# Altium project apu.PrjPcb
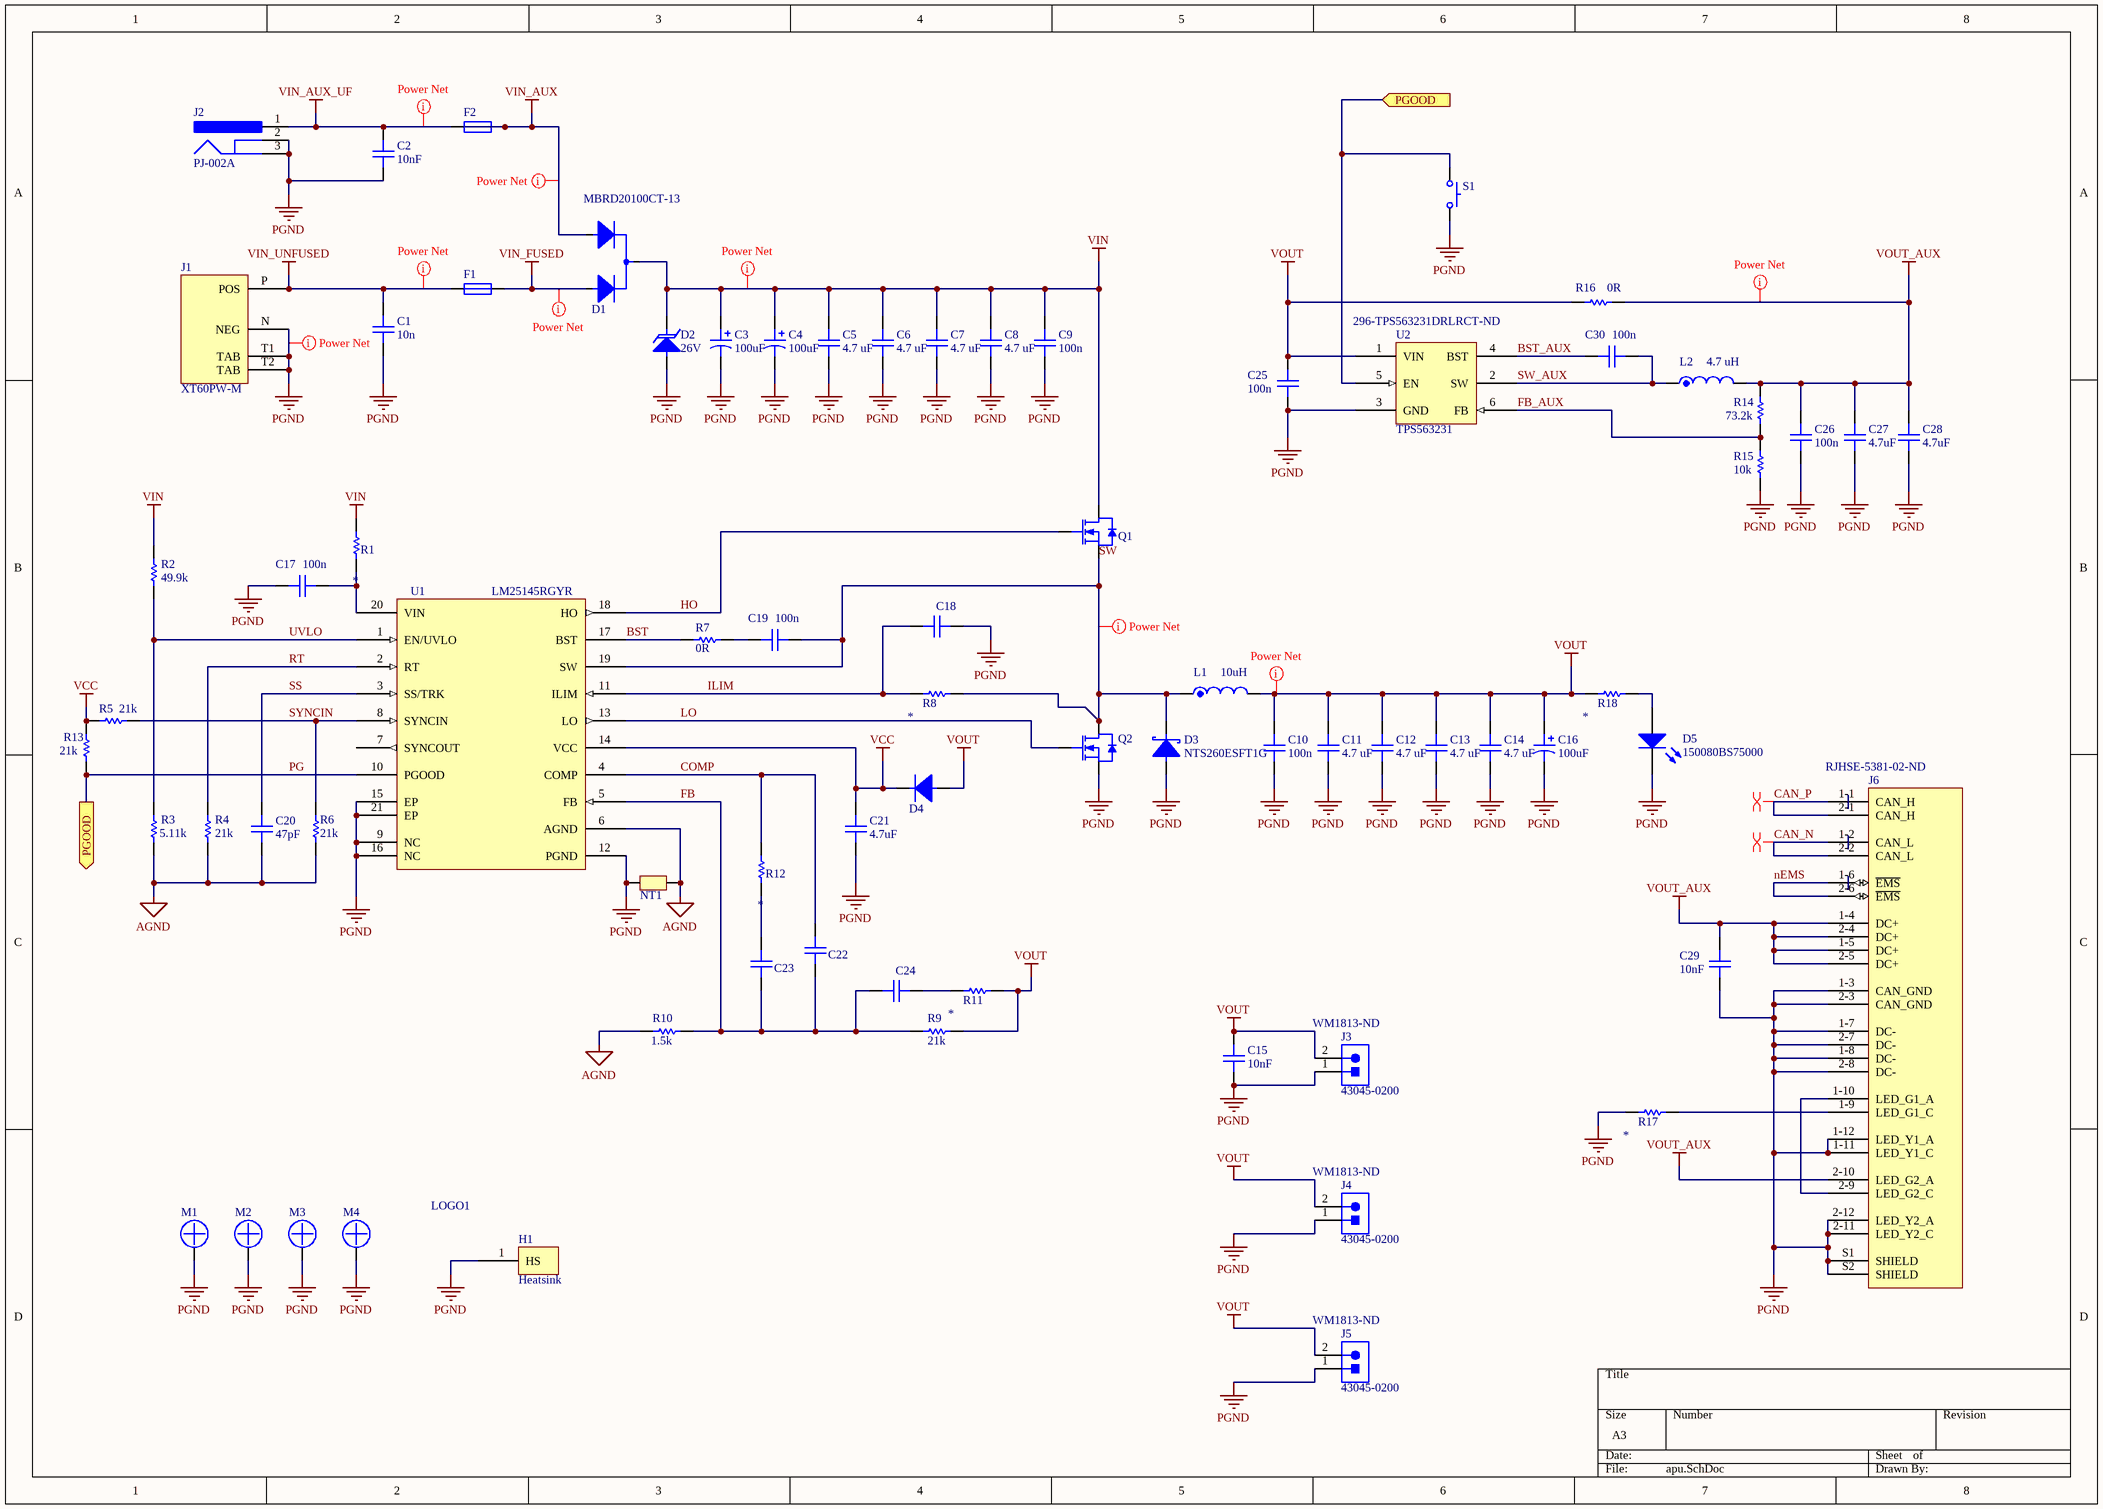
[diagram p0: apu.SchDoc]
1 sheet, 75 parts. Net scope: flat (ports and power ports of the same name join across sheets).
Board files: apu.PcbDoc, apu_panelized.PcbDoc

## Sheet apu.SchDoc
size A3

### Parts
C1  Capacitance: 10n  [C0603N]  (hidden comment: C)
C2  Capacitance: 10nF  [C0603N]  (hidden comment: C)
C3  Capacitance: 100uF  [CPOL_8x11_5_THRU]  (hidden comment: UHE1H101MPD)
C4  Capacitance: 100uF  [CPOL_8x11_5_THRU]  (hidden comment: UHE1H101MPD)
C5  Capacitance: 4.7 uF  [C1210N]  (hidden comment: UMK325B7475MM-P)
C6  Capacitance: 4.7 uF  [C1210N]  (hidden comment: UMK325B7475MM-P)
C7  Capacitance: 4.7 uF  [C1210N]  (hidden comment: UMK325B7475MM-P)
C8  Capacitance: 4.7 uF  [C1210N]  (hidden comment: UMK325B7475MM-P)
C9  DisplayValue: 100n  [C0603N]  (hidden comment: C)
C10  DisplayValue: 100n  [C0603N]  (hidden comment: C)
C11  Capacitance: 4.7 uF  [C1210N]  (hidden comment: UMK325B7475MM-P)
C12  Capacitance: 4.7 uF  [C1210N]  (hidden comment: UMK325B7475MM-P)
C13  Capacitance: 4.7 uF  [C1210N]  (hidden comment: UMK325B7475MM-P)
C14  Capacitance: 4.7 uF  [C1210N]  (hidden comment: UMK325B7475MM-P)
C15  Capacitance: 10nF  [C0603N]  (hidden comment: C)
C16  Capacitance: 100uF  [CPOL_8x11_5_THRU]  (hidden comment: UHE1H101MPD)
C17  DisplayValue: 100n  [C0603N]  (hidden comment: C)
C18  (no value)  [C0603N]
C19  DisplayValue: 100n  [C0603N]  (hidden comment: C)
C20  Capacitance: 47pF  [C0603N]  (hidden comment: 885012006055)
C21  Capacitance: 4.7uF  [C0805N]  (hidden comment: TMK212ABJ475KG-T)
C22  (no value)  [C0603N]
C23  (no value)  [C0603N]
C24  (no value)  [C0603N]
C25  DisplayValue: 100n  [C0603N]  (hidden comment: C)
C26  DisplayValue: 100n  [C0603N]  (hidden comment: C)
C27  Capacitance: 4.7uF  [C0805N]  (hidden comment: TMK212ABJ475KG-T)
C28  Capacitance: 4.7uF  [C0805N]  (hidden comment: TMK212ABJ475KG-T)
C29  Capacitance: 10nF  [C0603N]  (hidden comment: C)
C30  DisplayValue: 100n  [C0603N]  (hidden comment: C)
D1  MBRD20100CT-13  [DPAK_JEDEC_N]
D2  Reverse Standoff Voltage: 26V  [SMB]  (hidden comment: SMBJ26A-E3/52)
D3  NTS260ESFT1G  [SOD-123FLN]
D4  (no value)  [SOD323FLN]
D5  150080BS75000  [0805_A]
F1  FUSE  [LITTELFUSE_154]  (value not drawn)
F2  FUSE  [LITTELFUSE_154]  (value not drawn)
H1  Heatsink  [HS_2510]
J1  XT60PW-M  [XT60PW-M]
J2  PJ-002A  [CUI-PJ-002A_V]
J3  43045-0200  Supplier Part Number 1: WM1813-ND  [43045-020X]
J4  43045-0200  Supplier Part Number 1: WM1813-ND  [43045-020X]
J5  43045-0200  Supplier Part Number 1: WM1813-ND  [43045-020X]
J6  Supplier Part Number 1: RJHSE-5381-02-ND  [RJHSE-X38X-02]  (hidden comment: RJHSE-5381-02)
L1  Inductance: 10uH  [SRP1265A]  (hidden comment: SRP1265A-100M)
L2  Capacitance: 4.7 uH  [VLS5045EX_TDK]
LOGO1  LOGO  [LOGO_designed_by_ysk]  (value not drawn)  (graphical)
M1  Mounting_Screw  [MOUNT_HOLE_3.2]  (value not drawn)  (no BOM)
M2  Mounting_Screw  [MOUNT_HOLE_3.2]  (value not drawn)  (no BOM)
M3  Mounting_Screw  [MOUNT_HOLE_3.2]  (value not drawn)  (no BOM)
M4  Mounting_Screw  [MOUNT_HOLE_3.2]  (value not drawn)  (no BOM)
NT1  Net tie  [NET_TIE_0_2]  (value not drawn)  (net tie, no BOM)
Q1  MOSFET-N  [DFN-5 (SO-8FL)]  (value not drawn)
Q2  MOSFET-N  [DFN-5 (SO-8FL)]  (value not drawn)
R1  R  [R0603N]  (value not drawn)
R2  Resistance: 49.9k  [R0603N]  (hidden comment: R)
R3  Resistance: 5.11k  [R0603N]  (hidden comment: R)
R4  Resistance: 21k  [R0603N]  (hidden comment: R)
R5  Resistance: 21k  [R0603N]  (hidden comment: R)
R6  Resistance: 21k  [R0603N]  (hidden comment: R)
R7  Resistance: 0R  [R0603N]  (hidden comment: R)
R8  R  [R0603N]  (value not drawn)
R9  Resistance: 21k  [R0603N]  (hidden comment: R)
R10  Resistance: 1.5k  [R0603N]  (hidden comment: R)
R11  R  [R0603N]  (value not drawn)
R12  R  [R0603N]  (value not drawn)
R13  Resistance: 21k  [R0603N]  (hidden comment: R)
R14  Resistance: 73.2k  [R0603N]  (hidden comment: R)
R15  Resistance: 10k  [R0603N]  (hidden comment: R)
R16  Resistance: 0R  [R1206N]  (hidden comment: R)
R17  R  [R0603N]  (value not drawn)
R18  R  [R0603N]  (value not drawn)
S1  SW  [SW_TACTILE_3x6]  (value not drawn)
U1  Manufacturer Part Number 1: LM25145RGYR  [RGY0020B_TI_N]
U2  TPS563231  Supplier Part Number 1: 296-TPS563231DRLRCT-ND  [DRL0006A_TI_N]

### Ports
PGOOD (in), PGOOD (out)

### Nets
AGND: C20.1 NT1.2 R3.1 R4.1 R6.2 R10.1 U1.6(AGND)
PGND: C1.2 C2.2 C3.2 C4.2 C5.1 C6.1 C7.1 C8.1 C9.2 C10.2 C11.1 C12.1 C13.1 C14.1 C15.2 C16.2 C17.2 C18.1 C21.1 C25.2 C26.2 C27.1 C28.1 C29.2 D2.2(A) D3.2(A) D5.1(K) H1.1(HS) J1.N(NEG) J1.T1(TAB) J1.T2(TAB) J2.2 J2.3 J3.1 J4.1 J5.1 J6.1-3(CAN_GND) J6.1-7(DC-) J6.1-8(DC-) J6.1-11(LED_Y1_C) J6.1-12(LED_Y1_A) J6.2-3(CAN_GND) J6.2-7(DC-) J6.2-8(DC-) J6.2-11(LED_Y2_C) J6.2-12(LED_Y2_A) J6.S1(SHIELD) J6.S2(SHIELD) M1.1 M2.1 M3.1 M4.1 NT1.1 Q2.S R15.1 R17.2 S1.1 U1.9(NC) U1.12(PGND) U1.15(EP) U1.16(NC) U1.21(EP) U2.3(GND)
VCC: C21.2 D4.1(C) R5.2 R13.2 U1.14(VCC)
VIN: C3.1 C4.1 C5.2 C6.2 C7.2 C8.2 C9.1 D1.2(C) D2.1(C) Q1.D R1.1 R2.2
VIN_AUX: D1.3(A2) F2.2
VIN_AUX_UF: C2.1 F2.1 J2.1
VIN_FUSED: D1.1(A1) F1.2
VIN_UNFUSED: C1.1 F1.1 J1.P(POS)
VOUT: C10.1 C11.2 C12.2 C13.2 C14.2 C15.1 C16.1 C25.1 D4.2(A) J3.2 J4.2 J5.2 L1.2 R9.2 R11.2 R16.1 R18.2 U2.1(VIN)
VOUT_AUX: C26.1 C27.2 C28.2 C29.1 J6.1-4(DC+) J6.1-5(DC+) J6.2-4(DC+) J6.2-5(DC+) J6.2-10(LED_G2_A) L2.2 R14.2 R16.2
BST: R7.1 U1.17(BST)
BST_AUX: C30.1 U2.4(BST)
CAN_N: J6.1-2(CAN_L) J6.2-2(CAN_L)
CAN_P: J6.1-1(CAN_H) J6.2-1(CAN_H)
COMP: C22.1 R12.2 U1.4(COMP)
FB: C22.2 C23.2 C24.2 R9.1 R10.2 U1.5(FB)
FB_AUX: R14.1 R15.2 U2.6(FB)
HO: Q1.G U1.18(HO)
ILIM: C18.2 R8.1 U1.11(ILIM)
LO: Q2.G U1.13(LO)
nEMS: J6.1-6(~{EMS}) J6.2-6(~{EMS})
PG: R13.1 S1.1 U1.10(PGOOD) U2.5(EN) ; port PGOOD
RT: R4.2 U1.2(RT)
SS: C20.2 U1.3(SS/TRK)
SW: C19.1 D3.1(C) L1.1 Q1.S Q2.D R8.2 U1.19(SW)
SW_AUX: C30.2 L2.1 U2.2(SW)
SYNCIN: R5.1 R6.1 U1.8(SYNCIN)
UVLO: R2.1 R3.2 U1.1(EN/UVLO)
NetC17_1: C17.1 R1.2 U1.20(VIN)
NetC19_2: C19.2 R7.2
NetC23_1: C23.1 R12.1
NetC24_1: C24.1 R11.1
NetD5_2: D5.2(A) R18.1
NetJ6_1-9: J6.1-9(LED_G1_C) R17.1
NetJ6_1-10: J6.1-10(LED_G1_A) J6.2-9(LED_G2_C)

Not connected (* = marked no-connect by the designer): U1 7(SYNCOUT)

### Layout directives
net class Power: PGND, SW, VIN, VIN_AUX, VIN_AUX_UF, VIN_FUSED, VIN_UNFUSED, VOUT, VOUT_AUX
differential pair: CAN_N, CAN_P

### Library data of the parts
C1 C2 C15 C29 = C: CAP CER, 0.01UF, 50V, X7R, +/-20%, 0603; Manufacturer 1: Any; Voltage: 50V; Dielectric: X7R
C3 C4 = CPOL: CAP ALUM 100UF 20% 50V RADIAL; Manufacturer 1: Nichicon; Dielectric Material: Aluminium; Life (Hours): 7000Hour; Ripple Current: 555mA; Impedance: 170mR; ESR (Equivalent Series Resistance): 680mR; Dissipation Factor: 0.1%; Leakage Current: 50uA; Lead Diameter: 0.6mm; Supplier 1: Digi-Key; Supplier Part Number 1: 493-1605-ND; Manufacturer Part Number 1: UHE1H101MPD; RoHS: Yes; Category: Aluminum Electrolytic Capacitors; Stock 1: 29617; Pricing 1: 1=0.45000, 10=0.31600, 100=0.20800, 500=0.15408, 1000=0.13097, 2500=0.12326, 5000=0.11556 (USD); Mount: Through Hole; Case/Package: Radial; Min Operating Temperature: -40°C; Max Operating Temperature: 105°C; Termination: Radial; Voltage Rating: 50V; Tolerance: 20%; Packaging: Bulk; Package Quantity: 200; Voltage: 50V; Voltage Rating (DC): 50V; Diameter: 8mm; Length: 11.5mm; Height: 11.5mm; Height - Seated (Max): 0.453inch; Lead Pitch: 3.5mm; Radiation Hardening: No; REACH SVHC: No SVHC; Lead Free: Lead Free; ComponentLink1URL: https://datasheet.ciiva.com/11782/0900766b80634fdd-11782865.pdf?src-supplier=RSComponents; ComponentLink1Description: https://datasheet.ciiva.com/11782/0900766b80634fdd-11782865.pdf?src-supplier=RSComponents; ComponentLink2URL: https://datasheet.ciiva.com/98/e-he-98380.pdf?src-supplier=Digi-Key; ComponentLink2Description: https://datasheet.ciiva.com/98/e-he-98380.pdf?src-supplier=Digi-Key; ComponentLink3URL: https://datasheet.ciiva.com/11685/e-he-11685006.pdf?src-supplier=Avnet; ComponentLink3Description: https://datasheet.ciiva.com/11685/e-he-11685006.pdf?src-supplier=Avnet
C5-C8 C11-C14 = C: CAP CER 4.7UF 50V X7R 1210; Manufacturer 1: Taiyo Yuden; Manufacturer Part Number 1: UMK325B7475MM-P; Voltage: 50 V; Dielectric: X7R
C9 C10 C17 C19 C25 C26 C30 = C: CAP CER, 0.1UF, 50V, X7R, +/-20%, 0603; Manufacturer 1: Any; Capacitance: 100 nF
  C9 C10 C25 C26 C30: Voltage: 50 V; Dielectric: X7R
  C17: ClassName: Controller; Voltage: 50 V; Dielectric: X7R
  C19: ClassName: Controller
C16 = CPOL: CAP ALUM 100UF 20% 50V RADIAL; Manufacturer 1: Nichicon; Dielectric Material: Aluminium; Ripple Current: 555mA; Life (Hours): 7000Hour; Impedance: 170mR; ESR (Equivalent Series Resistance): 680mR; Dissipation Factor: 0.1%; Leakage Current: 50uA; Lead Diameter: 0.6mm; Supplier 1: Digi-Key; Supplier Part Number 1: 493-1605-ND; Manufacturer Part Number 1: UHE1H101MPD; RoHS: Yes; Category: Aluminum Electrolytic Capacitors; Stock 1: 29617; Pricing 1: 1=0.45000, 10=0.31600, 100=0.20800, 500=0.15408, 1000=0.13097, 2500=0.12326, 5000=0.11556 (USD); Mount: Through Hole; Case/Package: Radial; Min Operating Temperature: -40°C; Max Operating Temperature: 105°C; Termination: Radial; Tolerance: 20%; Voltage Rating: 50V; Packaging: Bulk; Package Quantity: 200; Voltage: 50V; Voltage Rating (DC): 50V; Diameter: 8mm; Length: 11.5mm; Height: 11.5mm; Lead Pitch: 3.5mm; Height - Seated (Max): 0.453inch; Radiation Hardening: No; REACH SVHC: No SVHC; Lead Free: Lead Free; ComponentLink1URL: https://datasheet.ciiva.com/11782/0900766b80634fdd-11782865.pdf?src-supplier=RSComponents; ComponentLink1Description: https://datasheet.ciiva.com/11782/0900766b80634fdd-11782865.pdf?src-supplier=RSComponents; ComponentLink2URL: https://datasheet.ciiva.com/98/e-he-98380.pdf?src-supplier=Digi-Key; ComponentLink2Description: https://datasheet.ciiva.com/98/e-he-98380.pdf?src-supplier=Digi-Key; ComponentLink3URL: https://datasheet.ciiva.com/11685/e-he-11685006.pdf?src-supplier=Avnet; ComponentLink3Description: https://datasheet.ciiva.com/11685/e-he-11685006.pdf?src-supplier=Avnet
C18 C22-C24 = C: ClassName: Controller
C20 = C: CAP CER 47PF 50V C0G/NP0 0603; Manufacturer 1: Wurth Electronics; Tolerance: 5%; ClassName: Controller; Supplier 1: Digi-Key; Supplier Part Number 1: 732-7797-1-ND; Manufacturer Part Number 1: 885012006055; RoHS: Yes; Category: Ceramic Capacitors; Stock 1: 2520; Pricing 1: 1=0.10000, 10=0.02700, 100=0.02440, 500=0.02158 (USD); Mount: Surface Mount; Case/Package: 0603; Case Code (Imperial): 0603; Case Code (Metric): 1608; Min Operating Temperature: -55°C; Max Operating Temperature: 125°C; Packaging: Cut Tape; Voltage Rating: 50V; Length: 0.063inch; Width: 0.031inch; Thickness: 0.034inch; ComponentLink1URL: http://www.farnell.com/datasheets/2031677.pdf?src-supplier=Farnell; ComponentLink1Description: http://www.farnell.com/datasheets/2031677.pdf?src-supplier=Farnell; ComponentLink2URL: https://katalog.we-online.de/pbs/datasheet/885012006055.pdf?src-supplier=Digi-Key; ComponentLink2Description: https://katalog.we-online.de/pbs/datasheet/885012006055.pdf?src-supplier=Digi-Key; ComponentLink3URL: http://www.farnell.com/datasheets/2031677.pdf?src-supplier=Newark; ComponentLink3Description: http://www.farnell.com/datasheets/2031677.pdf?src-supplier=Newark
C21 C27 C28 = C: CAP, MLCC , 0805, 25V , X5R, 4.7UF;; Manufacturer 1: Taiyo Yuden; Description: Prices include import duty and tax. CAPACITOR, MLCC , 0805, 25V , X5R, 4.7UF;; Tolerance: 10%; Supplier 1: Digi-Key; Supplier Part Number 1: 587-5478-1-ND; Manufacturer Part Number 1: TMK212ABJ475KG-T; RoHS: Yes; Category: Ceramic Capacitors; Stock 1: 6871; Pricing 1: 1=0.21000, 10=0.14700, 100=0.06930, 500=0.04862, 1000=0.04025 (USD); Mount: Surface Mount; Case/Package: Ceramic; Contact Plating: Tin; Min Operating Temperature: -55°C; Max Operating Temperature: 85°C; Dielectric: X5R; Termination: Wraparound; Length: 2mm; ComponentLink1URL: http://www.yuden.co.jp/productdata/catalog/en/mlcc_all_e.pdf?src-supplier=Avnet+Asia; ComponentLink1Description: http://www.yuden.co.jp/productdata/catalog/en/mlcc_all_e.pdf?src-supplier=Avnet+Asia
  C21: ClassName: Controller
D1 = D_CC: DIODE SCHOTTKY 100V 10A TO252; pin to pad: 2>4; Manufacturer: Diodes; Element Configuration: Common Cathode; Forward Current: 20A; Forward Voltage: 840mV; Max Forward Surge Current (Ifsm): 150A; Peak Reverse Current: 100uA; Supplier 1: Digi-Key; Supplier Part Number 1: MBRD20100CT-13DICT-ND; Manufacturer Part Number: MBRD20100CT-13; RoHS: Yes; Category: Rectifier Diodes; Stock 1: 7298; Pricing 1: 1=0.59000, 10=0.51700, 25=0.48520, 100=0.35220, 250=0.33972, 500=0.29432, 1000=0.25048 (USD); Mount: Surface Mount; Case/Package: TO-252-3; Weight: 0.012346oz; Min Operating Temperature: -55°C; Max Operating Temperature: 175°C; Max Reverse Voltage (DC): 100V; Packaging: Tape and Reel; Average Rectified Current: 10A; Max Repetitive Reverse Voltage (Vrrm): 100V; Package Quantity: 2500; Reverse Voltage (DC): 100V; Lead Free: Lead Free; ComponentLink1URL: http://www.mouser.com/ds/2/115/MBRD20100CT-520272.pdf?src-supplier=Mouser; ComponentLink1Description: http://www.mouser.com/ds/2/115/MBRD20100CT-520272.pdf?src-supplier=Mouser; ComponentLink2URL: https://www.diodes.com/assets/Datasheets/MBRD20100CT.pdf?src-supplier=Digi-Key; ComponentLink2Description: https://www.diodes.com/assets/Datasheets/MBRD20100CT.pdf?src-supplier=Digi-Key
D2 = TVS: Diode TVS Single Uni-Dir 26V 600W 2-Pin SMB T/R; Manufacturer 1: Vishay Semiconductors; Clamping Voltage: 42.1V; Polarity: Unidirectional; Peak Pulse Current: 14.3A; Test Current: 1mA; Number of Elements: 1; Reverse Breakdown Voltage: 28.9V; Leakage Current: 1uA; Max Breakdown Voltage: 31.9V; Supplier 1: Digi-Key; Supplier Part Number 1: SMBJ26A-E3/52GICT-ND; Manufacturer Part Number 1: SMBJ26A-E3/52; RoHS: Yes; Category: TVS Diodes; Stock 1: 6037; Pricing 1: 1=0.47000, 10=0.35600, 25=0.32080, 100=0.16910, 250=0.16732 (USD); Mount: Surface Mount; Case/Package: SMB; Number of Pins: 2; Min Operating Temperature: -55°C; Max Operating Temperature: 150°C; Packaging: Tape and Reel; Peak Pulse Power: 600W; Package Quantity: 750; Max Surge Current: 14.3A; Breakdown Voltage: 28.9V; Operating Supply Voltage: 26V; Number of Channels: 1; Min Breakdown Voltage: 28.9V; Direction: Unidirectional; Termination: SMD/SMT; Max Reverse Leakage Current: 1uA; Element Configuration: Single; Max Power Dissipation: 600W; Power Dissipation: 600W; Length: 4.7mm; Height: 2.44mm; Width: 3.8mm; Radiation Hardening: No; Lead Free: Lead Free; REACH SVHC: Unknown; ComponentLink1URL: https://datasheet.ciiva.com/26322/1682810-26322576.pdf?src-supplier=Element14; ComponentLink1Description: https://datasheet.ciiva.com/26322/1682810-26322576.pdf?src-supplier=Element14; ComponentLink2URL: https://datasheet.ciiva.com/26912/getdatasheetpartid-295613-26912708.pdf?src-supplier=Verical; ComponentLink2Description: https://datasheet.ciiva.com/26912/getdatasheetpartid-295613-26912708.pdf?src-supplier=Verical; ComponentLink3URL: https://datasheet.ciiva.com/330/smbj50a-330924.pdf?src-supplier=Digi-Key; ComponentLink3Description: https://datasheet.ciiva.com/330/smbj50a-330924.pdf?src-supplier=Digi-Key; ComponentLink4URL: https://datasheet.ciiva.com/330/smbj50a-330925.pdf?src-supplier=Digi-Key; ComponentLink4Description: https://datasheet.ciiva.com/330/smbj50a-330925.pdf?src-supplier=Digi-Key; ComponentLink5URL: https://datasheet.ciiva.com/330/smbj50a-330923.pdf?src-supplier=Digi-Key; ComponentLink5Description: https://datasheet.ciiva.com/330/smbj50a-330923.pdf?src-supplier=Digi-Key
D3 = SBD: DIODE SCHOTTKY 60V 2A SOD123FL; Manufacturer 1: ON Semiconductor; Supplier 1: Digi-Key; Supplier Part Number 1: NTS260ESFT3GOSCT-ND; Manufacturer Part Number 1: NTS260ESFT1G; RoHS: No; Category: Schottky Diodes; Stock 1: 28733; Pricing 1: 1=0.47000, 10=0.35200, 25=0.30800, 100=0.16720, 250=0.16632, 500=0.13640, 1000=0.10120, 2500=0.08888, 5000=0.08140 (USD); Mount: Surface Mount; Packaging: Cut Tape; Max Reverse Voltage (DC): 60V; Average Rectified Current: 2A; ComponentLink1URL: http://www.onsemi.com/pub/Collateral/NTS260ESF-D.PDF?src-supplier=Digi-Key; ComponentLink1Description: http://www.onsemi.com/pub/Collateral/NTS260ESF-D.PDF?src-supplier=Digi-Key
D4 = D
D5 = CMP-1426-00008-1: SMD mono-color Chip LED, WL-SMCW, Blue; Manufacturer: Wuerth Elektronik; Color: Blue; ComponentLink2URL: http://katalog.we-online.com/led/datasheet/150080BS75000.pdf; ComponentLink1URL: http://www.we-online.com; ComponentLink2Description: Datasheet; PackageReference: 0805_A; ComponentLink1Description: Manufacturer URL; PartNumber: 150080BS75000
H1 = Heatsink: Manufacturer 1: Any
J1 = XT60PW-M: XT60, Male, THT, R/A; Manufacturer 1: Amass; Manufacturer Part Number 1: XT60PW-M
J2 = CMP-2000-06895-1: Through Hole Right Angle DC Power Jack, 2.5 A, 2 mm Center Pin, 3 Position, -25 to 85 degC, RoHS, Bulk; Manufacturer: CUIInc.; Manufacturer Part Number: PJ-002B; Current Rating: 2.5A; Inside Contact Diameter: 2mm; Insulation Resistance: 50MOhms; Outside Contact Diameter: 6.5mm; Voltage Rating: 24V; Brand: CUI; Gender: Male; Shielding: Unshielded; Number of Conductors: 2; Operating Temperature Range: -25Cto+85C; Mounting Technology: ThroughHole; Connector Type: DCPowerJack; Contact Material: Copper; Datasheet URL: http://www.cui.com/product/resource/pj-002a.pdf; Contact Gender: Male; Housing Material: PolybutyleneTerephthalate(PBT); Manufacturer URL: http://www.cui.com/; Package Reference: PJ-002A; Mounting Style: ThroughHole; Mounting Angle: Right; Product Category: DCPowerConnectors; Product: Jacks; Flammability Rating: UL94V-0; Contact Plating: Nickel; RoHS: True; Datasheet Version: Rev. 1.03, 04/2016; Package Description: 3-Pin Through Hole Device, Body 14.4 x 9 mm, Height 11 mm; Factory Pack Quantity: 500; Termination Style: ThroughHole; Supplier 1: Digi-Key; Supplier Part Number 1: CP-002B-ND; Category: Connectors; Stock 1: 14399; Pricing 1: 1=0.60000, 10=0.55800, 25=0.50240, 50=0.44640, 100=0.42780, 250=0.39060, 500=0.37200, 1000=0.30690, 2500=0.27900 (USD); Mount: Through Hole; Color: Black; Housing Color: Black; Min Operating Temperature: -25°C; Max Operating Temperature: 85°C; Termination: Through Hole; Package Quantity: 500; Orientation: Horizontal; Packaging: Bulk; Diameter: 2.5mm; Lead Free: Lead Free; ComponentLink1URL: http://www.mouser.com/ds/2/670/pj-002b-515833.pdf?src-supplier=Mouser; ComponentLink1Description: http://www.mouser.com/ds/2/670/pj-002b-515833.pdf?src-supplier=Mouser; ComponentLink2URL: http://www.cui.com/Product/Resource/FuturePDF/PJ-002B.pdf?src-supplier=Future+Electronics; ComponentLink2Description: http://www.cui.com/Product/Resource/FuturePDF/PJ-002B.pdf?src-supplier=Future+Electronics; ComponentLink3URL: https://www.cui.com/product/resource/digikeypdf/pj-002b.pdf?src-supplier=Digi-Key; ComponentLink3Description: https://www.cui.com/product/resource/digikeypdf/pj-002b.pdf?src-supplier=Digi-Key
J3-J5 = 43045-020X: Header 2 Row Right-Angle Snap-In Lock 2Pin Tin Plate SMT/Glow Wire Compatible; Manufacturer 1: Molex; Number of Contacts: 2; Contact Resistance: 10mR; Connector Type: Male Pin; Max Voltage Rating (AC): 250V; Row Spacing: 0.118inch; Pitch: 3mm; Manufacturer Part Number 1: 43045-0200; Manufacturer 2: CJT; Manufacturer Part Number 2: C3030WR-2x1P; Supplier 1: Digi-Key; RoHS: Yes; Category: Headers and Wire Housings; Stock 1: 9268; Pricing 1: 1=0.97000, 10=0.84900, 100=0.73280, 500=0.59958, 1000=0.53296, 5000=0.46634, 10000=0.44302 (USD); Mount: Through Hole; Contact Plating: Tin; Color: Black; Contact Material: Brass; Housing Material: Polymer; Housing Color: Black; Min Operating Temperature: -40°C; Max Operating Temperature: 105°C; Termination: Solder; Number of Rows: 2; Orientation: Right Angle; Number of Positions: 2; Packaging: Tray; Fastening Type: Ramp; Length: 7.15mm; Depth: 12.2mm; Flammability Rating: UL94 V-0; ComponentLink1URL: https://datasheet.ciiva.com/712/430450200-sd-712017.pdf?src-supplier=Digi-Key; ComponentLink1Description: https://datasheet.ciiva.com/712/430450200-sd-712017.pdf?src-supplier=Digi-Key; ComponentLink2URL: https://datasheet.ciiva.com/3933/159670430450200-pcb-headers-3933176.pdf?src-supplier=Arrow; ComponentLink2Description: https://datasheet.ciiva.com/3933/159670430450200-pcb-headers-3933176.pdf?src-supplier=Arrow
J6 = RJHSE-X381-02: CONN MOD JACK 8P8C R/A SHIELDED; Manufacturer 1: Amphenol Commercial; Number of Contacts: 16; Voltage Rating: 125V; Contact Resistance: 20mR; Max Current Rating: 1.5A; Number of Ports: 2; Direction: Up; Number of Positions: 8; Connector Type: Jack,RJ45; Gender: Female; Pitch: 2.03mm; Supplier 1: Digi-Key; Manufacturer Part Number 1: RJHSE-5381-02; RoHS: Yes; Category: Modular / Ethernet Connectors; Stock 1: 1148; Pricing 1: 1=3.22000, 10=3.08900, 25=2.83160, 50=2.70280, 100=2.57400, 250=2.25224, 500=2.18790, 1000=1.86615, 2500=1.85900 (USD); Mount: Through Hole; Housing Material: Thermoplastic; Color: Black,Green,Yellow; Contact Plating: Gold; Contact Material: Bronze; Min Operating Temperature: -20°C; Max Operating Temperature: 85°C; Termination: Through Hole; Orientation: Right Angle; Packaging: Tray; Shielding: Shielded; Number of Rows: 1; Number of Positions Loaded: 16; Max Voltage Rating (AC): 125V; Current Rating: 1.5A; Package Quantity: 56; Length: 32.26mm; Radiation Hardening: No; Flammability Rating: UL94 V-0; REACH SVHC: Unknown; ComponentLink1URL: https://datasheet.ciiva.com/15170/getdatasheetpartid-43105-15170403.pdf?src-supplier=Verical; ComponentLink1Description: https://datasheet.ciiva.com/15170/getdatasheetpartid-43105-15170403.pdf?src-supplier=Verical; ComponentLink2URL: https://datasheet.ciiva.com/685/rjhse-538x-02-revc-685734.pdf?src-supplier=Digi-Key; ComponentLink2Description: https://datasheet.ciiva.com/685/rjhse-538x-02-revc-685734.pdf?src-supplier=Digi-Key; ComponentLink3URL: https://datasheet.ciiva.com/3138/rjhse-538x-02-revc-3138729.pdf?src-supplier=Avnet; ComponentLink3Description: https://datasheet.ciiva.com/3138/rjhse-538x-02-revc-3138729.pdf?src-supplier=Avnet; ComponentLink4URL: https://datasheet.ciiva.com/14118/04248001-14118878.pdf?src-supplier=Distrelec; ComponentLink4Description: https://datasheet.ciiva.com/14118/04248001-14118878.pdf?src-supplier=Distrelec
L1 = L: FIXED IND 10UH 10A 16.5 MOHM SMD; Manufacturer 1: Bourns; Core Material: Carbonyl Powder,Ferrite; Tolerance: 20%; Saturation Current: 15.5A; Shielding: Shielded; DC Resistance (DCR): 16.5mR; Self Resonant Frequency: 10MHz; Test Frequency: 100kHz; Q Factor: 20; Supplier 1: Digi-Key; Supplier Part Number 1: SRP1265A-100MCT-ND; Manufacturer Part Number 1: SRP1265A-100M; RoHS: Yes; Category: Fixed Inductors; Stock 1: 80083; Pricing 1: 1=1.68000, 10=1.55300, 100=1.08680 (USD); Mount: Surface Mount; Case/Package: Nonstandard; Min Operating Temperature: -40°C; Max Operating Temperature: 150°C; Packaging: Cut Tape; Composition: Wirewound; Current Rating: 10A; Termination: SMD/SMT; Max DC Current: 10A; RMS Current (Irms): 10A; Inductance Tolerance: 20%; Package Quantity: 500; Length: 13.5mm; Height: 6.2mm; Width: 0.492inch; Height - Seated (Max): 0.252inch; Depth: 12.5mm; Ratings: AEC-Q200; REACH SVHC: No SVHC; ComponentLink1URL: https://datasheet.ciiva.com/48685/srp1265a-48685289.pdf?src-supplier=Avnet; ComponentLink1Description: https://datasheet.ciiva.com/48685/srp1265a-48685289.pdf?src-supplier=Avnet; ComponentLink2URL: https://datasheet.ciiva.com/48685/srp1265a-48685292.pdf?src-supplier=Avnet; ComponentLink2Description: https://datasheet.ciiva.com/48685/srp1265a-48685292.pdf?src-supplier=Avnet
L2 = L
R1 R4-R13 R17 R18 = R: RES SMD, 10KOHM, 1%, 0.1W, 0603; Manufacturer: Any
  R1 R8 R11 R12: ClassName: Controller; Resistance: *
  R4-R7 R9 R10: ClassName: Controller
  R17 R18: Resistance: *
R2 = R: RES SMD, 49.9KOHM, 1%, 0.1W, 0603; Manufacturer: Any; ClassName: Controller
R3 = R: RES SMD, 5.11KOHM, 1%, 0.1W, 0603; Manufacturer: Any; ClassName: Controller
R14 R15 = R: RES SMD, 10KOHM, 1%, 0.1W, 0603; Manufacturer 1: Any; Manufacturer: Any
R16 = R: Manufacturer 1: Any
S1 = TactileSwitch: SW TACTILE
U1 = LM25145: 6-V to 42-V Synchronous Buck DC-DC Controller With Wide Duty Cycle Range; Manufacturer 1: Texas Instruments; Output Configuration: Positive; Number of Outputs: 1; Switching Frequency: 1MHz; Synchronous Rectifier: Yes; ClassName: Controller; Supplier 1: Digi-Key; Supplier Part Number 1: 296-48143-1-ND; RoHS: No; Stock 1: 1943; Pricing 1: 1=3.96000, 10=3.56000, 25=3.36600, 100=2.76760, 250=2.48336, 500=2.39360, 1000=1.98968 (USD); Case/Package: VQFN; Min Operating Temperature: -40°C; Max Operating Temperature: 125°C; Packaging: Cut Tape; Number of Output Phases: 1; Clock Sync: Yes; ComponentLink1URL: http://www.ti.com/lit/pdf/slyt741?src-supplier=Digi-Key; ComponentLink1Description: http://www.ti.com/lit/pdf/slyt741?src-supplier=Digi-Key
U2 = TPS563231: 4.5-V to 17-V input, 3-A synchronous step-down voltage regulator 6-SOT-5X3 -40 to 125; Manufacturer: Texas Instruments; Manufacturer Part Number: TPS563231DRLR; Supplier 1: Digi-Key; RoHS: No; Stock 1: 3922; Pricing 1: 1=0.83000, 10=0.72600, 25=0.68200, 100=0.51700, 250=0.44000, 500=0.41800, 1000=0.31900 (USD)